# EAGLE design keyboard_adc_v1 (EAGLE 5.11)
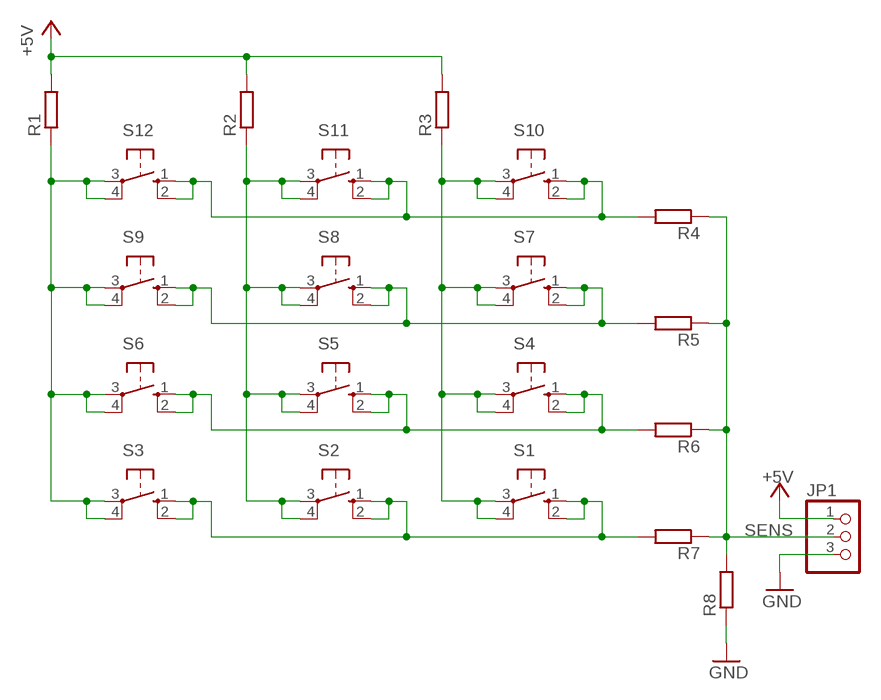
[diagram p0: schematic, sheet 1]

## Parts
JP1  PINHD-1X390  [1X03/90]
R1  R-EU_  [0207/7]
R2  R-EU_  [0207/7]
R3  R-EU_  [0207/7]
R4  R-EU_  [0207/7]
R5  R-EU_  [0207/7]
R6  R-EU_  [0207/7]
R7  R-EU_  [0207/7]
R8  R-EU_  [0207/7]
S1  10-XX  [B3F-10XX]
S2  10-XX  [B3F-10XX]
S3  10-XX  [B3F-10XX]
S4  10-XX  [B3F-10XX]
S5  10-XX  [B3F-10XX]
S6  10-XX  [B3F-10XX]
S7  10-XX  [B3F-10XX]
S8  10-XX  [B3F-10XX]
S9  10-XX  [B3F-10XX]
S10  10-XX  [B3F-10XX]
S11  10-XX  [B3F-10XX]
S12  10-XX  [B3F-10XX]

## Nets
+5V: JP1.1 R1.2 R2.2 R3.2
GND: JP1.3 R8.1
N$6: R4.2 S10.1(S) S10.2(S1) S11.1(S) S11.2(S1) S12.1(S) S12.2(S1)
N$10: R5.2 S7.1(S) S7.2(S1) S8.1(S) S8.2(S1) S9.1(S) S9.2(S1)
N$15: R6.2 S4.1(S) S4.2(S1) S5.1(S) S5.2(S1) S6.1(S) S6.2(S1)
N$18: R7.2 S1.1(S) S1.2(S1) S2.1(S) S2.2(S1) S3.1(S) S3.2(S1)
N$20: R1.1 S3.3(P) S3.4(P1) S6.3(P) S6.4(P1) S9.3(P) S9.4(P1) S12.3(P) S12.4(P1)
N$21: R2.1 S2.3(P) S2.4(P1) S5.3(P) S5.4(P1) S8.3(P) S8.4(P1) S11.3(P) S11.4(P1)
N$24: R3.1 S1.3(P) S1.4(P1) S4.3(P) S4.4(P1) S7.3(P) S7.4(P1) S10.3(P) S10.4(P1)
SENS: JP1.2 R4.1 R5.1 R6.1 R7.1 R8.2

## Library data of the parts
JP1 = keyboard_adc:PINHD-1X3: PIN HEADER
R1-R8 = keyboard_adc:R-EU_: RESISTOR, European symbol
S1-S12 = keyboard_adc:10-XX: OMRON SWITCH

## Board
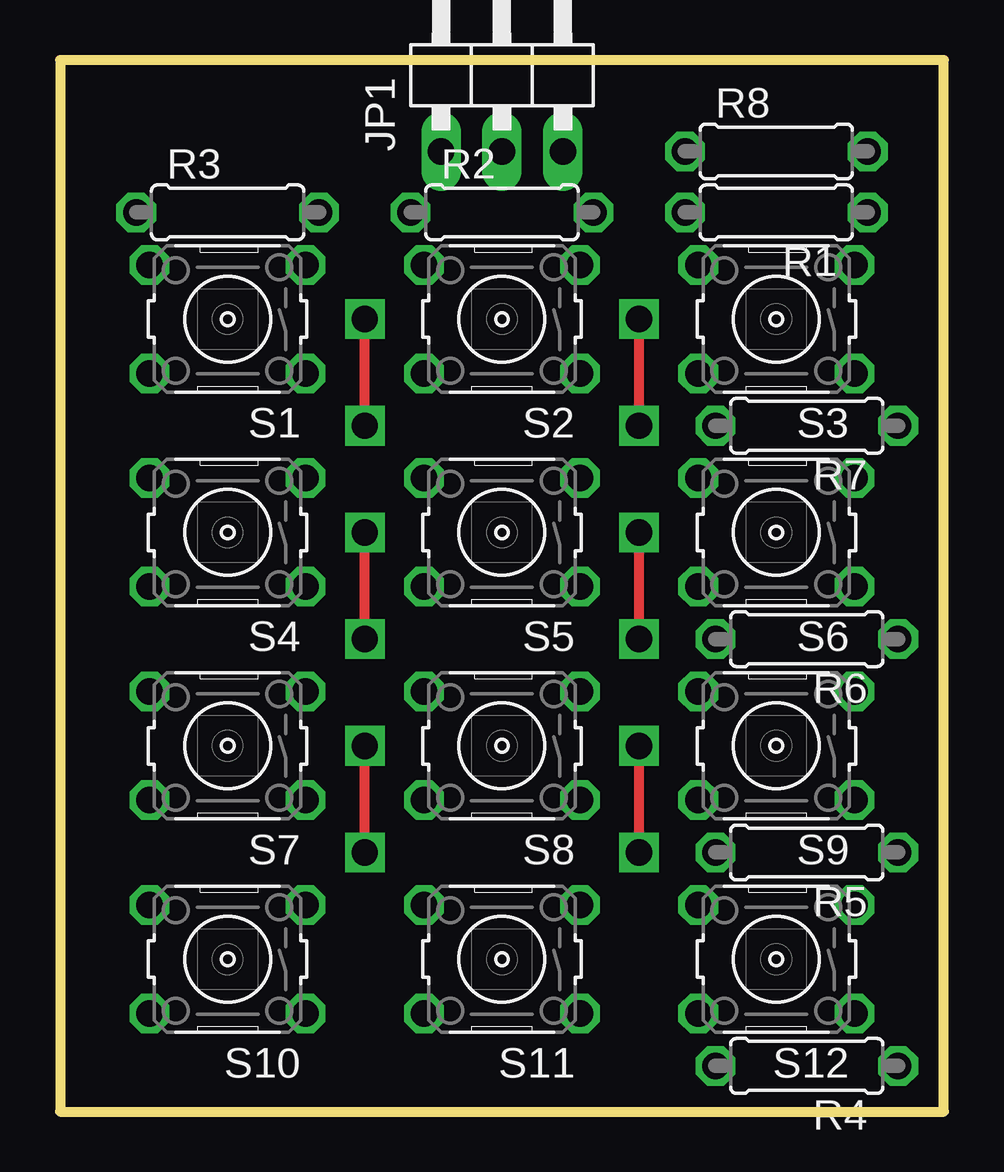
[diagram p1: board, top side]
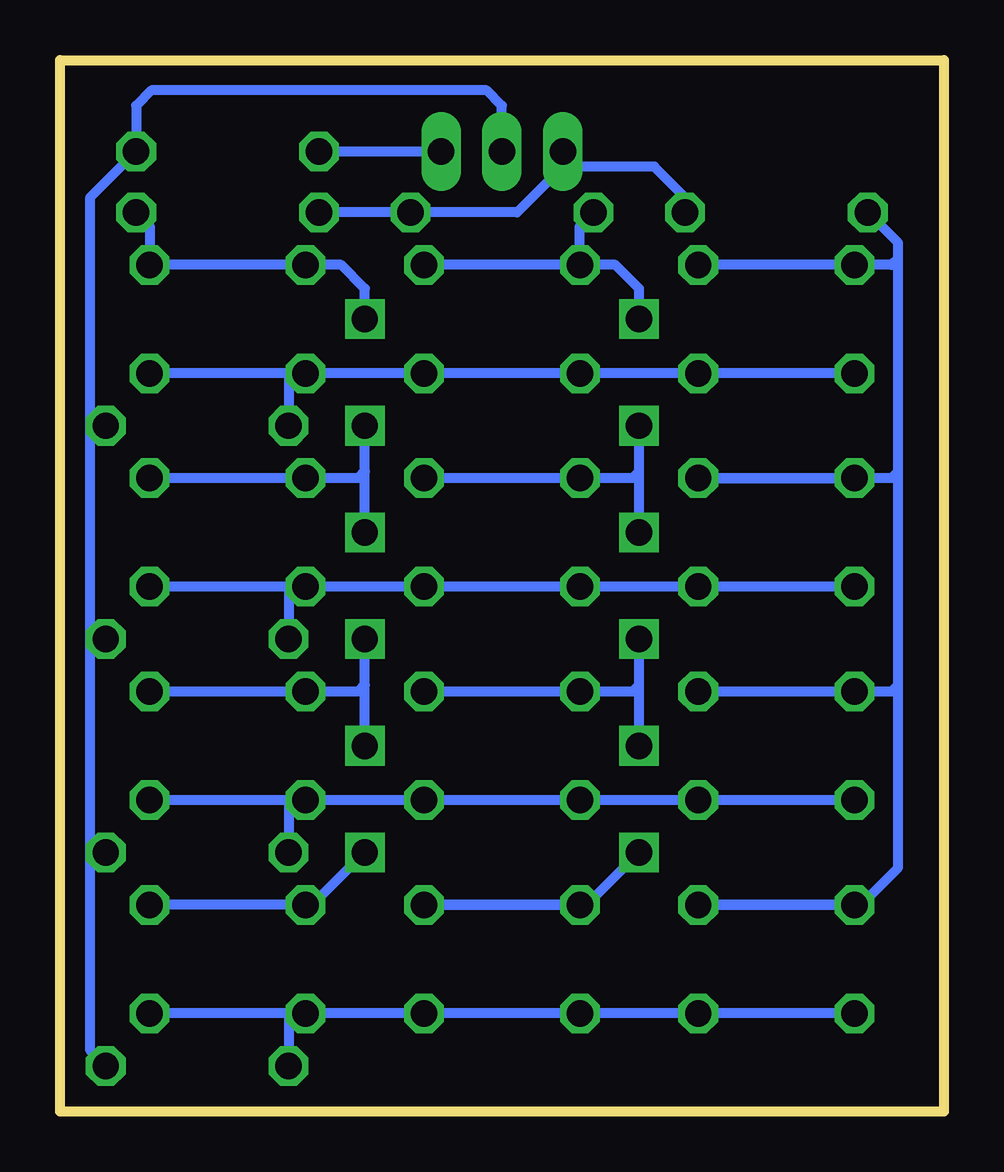
[diagram p2: board, bottom side, seen from below]

Size 36.83 x 43.81 mm. Coordinates in mm from the lower left corner, seen from the top.
Outline: 0,0 36.83,0 36.83,43.81 0,43.81 0,0
Copper layers (1*16): Top 0.035mm / dielectric 1.5mm / Bottom 0.035mm
Design rules "default": minimum track width 10mil, minimum drill 24mil, track to track 8mil, track to pad 8mil, pad to pad 8mil, via to via 8mil, smd to smd 8mil, copper to edge 40mil, drill to drill 8mil, minimum pad ring 10mil, minimum via ring 8mil, stop-mask expansion 4mil, vias tented up to drill 0mil, thermal gap 10mil

### Footprints (pad centres in the part's own frame; a part is rotated, then mirrored left to right if it is on the bottom)
1X03/90 = drill 1.1 long: 1 -2.54,-3.81; 2 0,-3.81; 3 2.54,-3.81
0207/7 = drill 1.1 octagon: 1 -3.81,0; 2 3.81,0
B3F-10XX = drill 1.1 octagon: 1 -3.251,2.261; 2 3.251,2.261; 3 -3.251,-2.261; 4 3.251,-2.261

### Placement (x,y rotation side)
JP1  18.41,43.81 0 top
R1  29.84,37.47 180 top
R2  18.41,37.47 0 top
R3  6.99,37.47 0 top
R4  31.11,1.91 180 top
R5  31.11,10.79 180 top
R6  31.11,19.68 180 top
R7  31.11,28.57 180 top
R8  29.84,40.01 0 top
S1  6.99,33.02 180 top
S2  18.41,33.02 180 top
S3  29.84,33.02 180 top
S4  6.99,24.13 180 top
S5  18.41,24.13 180 top
S6  29.84,24.13 180 top
S7  6.99,15.24 180 top
S8  18.41,15.24 180 top
S9  29.84,15.24 180 top
S10  6.99,6.35 180 top
S11  18.41,6.35 180 top
S12  29.84,6.35 180 top

### Tracks (layer width: path | path; a pad name or v marks a point on that pad's centre or on a via)
+5V
  Bottom 0.406: R3.2 10.79,38.1 12.06,39.37 15.88,39.37 | R1.2 R2.2 17.78,37.47 15.88,39.37 | 15.88,39.37 JP1.1
GND
  Bottom 0.406: R8.1 JP1.3
N$6
  Bottom 0.406: S10.2 S10.1 S11.2 S11.1 S12.2 27.3,4.09 | 27.3,4.09 S12.1 | 27.3,4.09 R4.2
N$10
  Bottom 0.406: S7.2 S7.1 S8.2 S8.1 S9.2 27.3,12.98 | 27.3,12.98 S9.1 | 27.3,12.98 R5.2
N$15
  Bottom 0.406: S4.2 S4.1 S5.2 S5.1 S6.2 27.3,21.87 | 27.3,21.87 S6.1 | 27.3,21.87 R6.2
N$18
  Bottom 0.406: S1.2 S1.1 S2.2 S2.1 S3.2 27.3,30.76 | 27.3,30.76 S3.1 | 27.3,30.76 R7.2
N$20  (via drill 1.1)
  Top 0.406: v24.13,10.79 v24.13,15.24 | v24.13,19.68 v24.13,24.13 | v24.13,28.57 v24.13,33.02
  Bottom 0.406: S6.3 S6.4 24.41,26.39 24.13,26.67 | S9.3 S9.4 24.41,17.5 24.13,17.78 | S12.3 S12.4 26.31,8.61 v24.13,10.79 | v24.13,33.02 24.13,34.29 25.12,35.28 S3.4 S3.3 33.1,36.91 R1.1 | v24.13,15.24 24.13,17.78 | 24.13,17.78 v24.13,19.68 | v24.13,24.13 24.13,26.67 | 24.13,26.67 v24.13,28.57
N$21  (via drill 1.1)
  Top 0.406: v12.7,10.79 v12.7,15.24 | v12.7,19.68 v12.7,24.13 | v12.7,28.57 v12.7,33.02
  Bottom 0.406: S2.4 S2.3 | S5.3 S5.4 12.98,26.39 12.7,26.67 | S8.3 S8.4 12.98,17.5 12.7,17.78 | S11.4 S11.3 14.88,8.61 v12.7,10.79 | v12.7,24.13 12.7,26.67 | 12.7,26.67 v12.7,28.57 | v12.7,15.24 12.7,17.78 | 12.7,17.78 v12.7,19.68 | S2.4 13.69,35.28 12.7,34.29 v12.7,33.02 | S2.4 15.16,36.91 R2.1
N$24
  Bottom 0.406: S10.4 S10.3 3.45,8.61 1.91,10.16 1.91,17.78 | S7.3 S7.4 2.18,17.5 1.91,17.78 | S4.4 S4.3 2.18,26.39 1.91,26.67 | S1.3 S1.4 2.18,35.28 1.91,35.56 | 1.91,17.78 1.91,26.67 | 1.91,26.67 1.91,35.56 | 1.91,35.56 1.91,36.2 R3.1
SENS
  Bottom 0.406: 35.56,10.79 35.56,19.68 | 35.56,10.79 R5.1 | 35.56,19.68 R6.1 | 35.56,19.68 35.56,28.57 | 35.56,28.57 R7.1 | 35.56,28.57 35.56,38.1 R8.2 33.66,41.91 33.02,42.55 19.05,42.55 18.41,41.91 JP1.2 | R4.1 35.56,2.54 35.56,10.79